# EAGLE schematic driver led v12 (EAGLE 9.7.0)
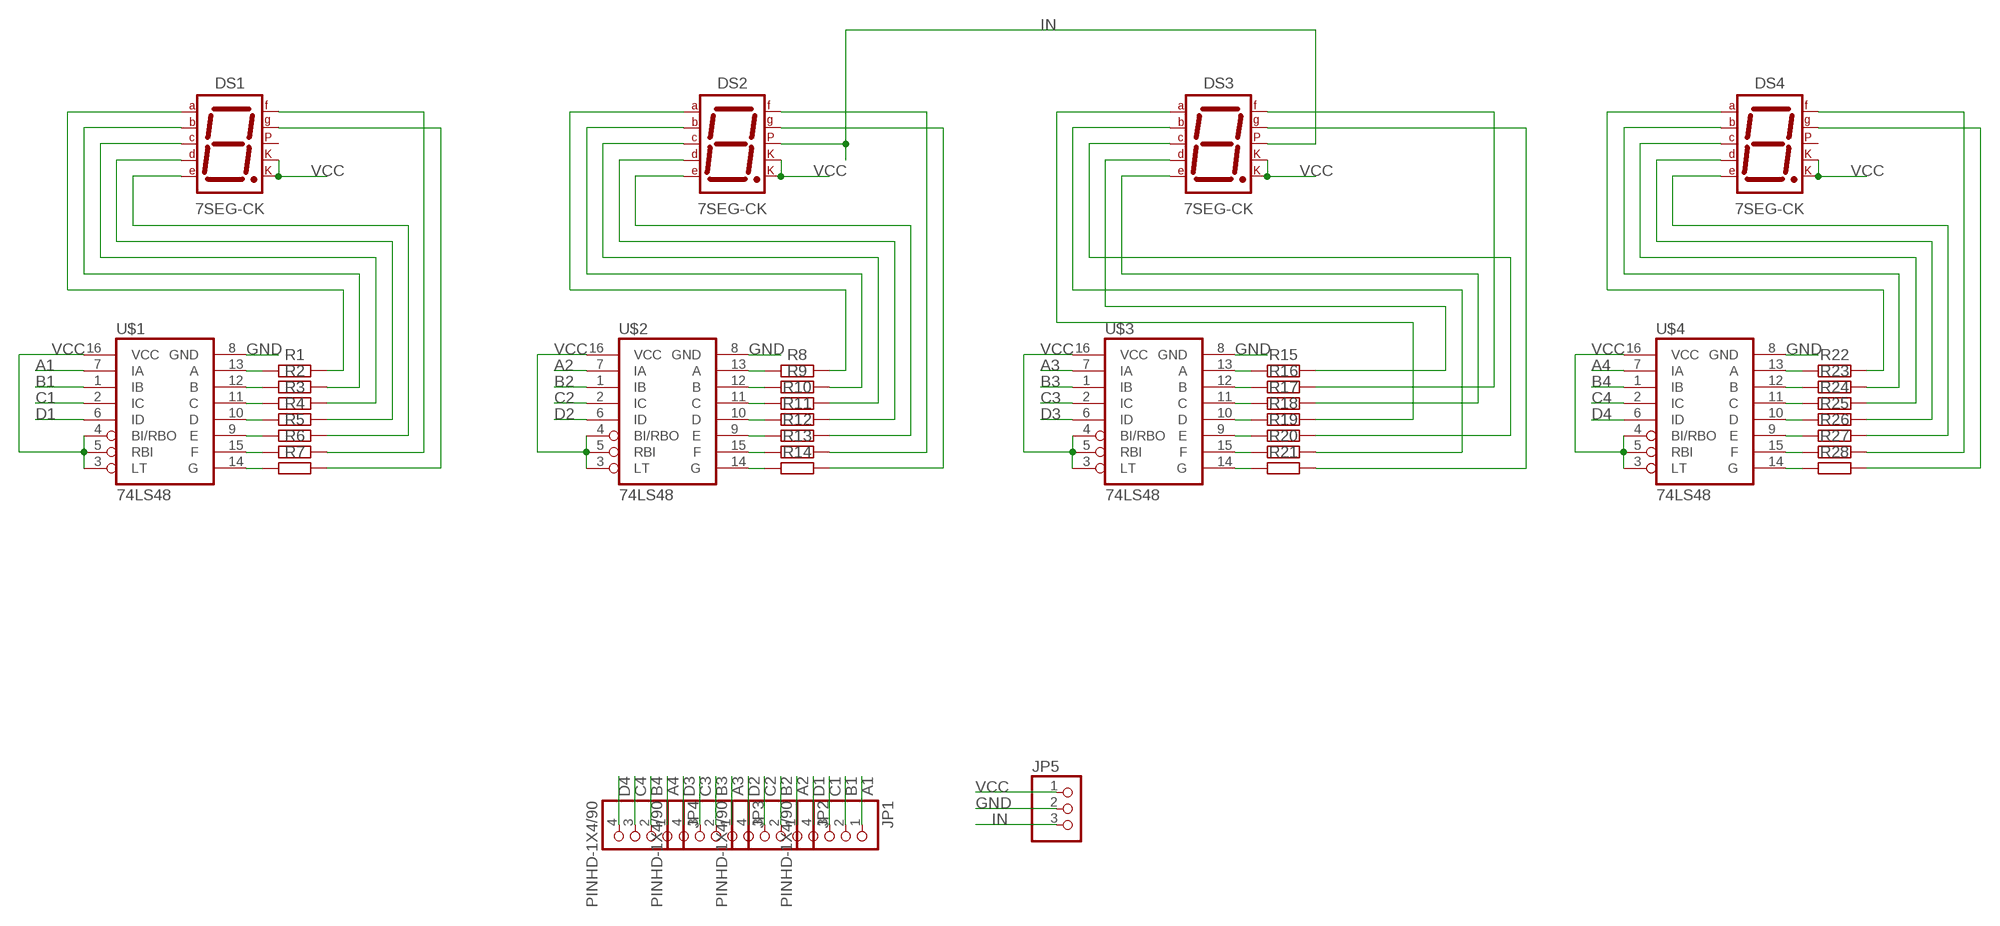
[diagram p0: schematic, sheet 1]

## Parts
DS1  7SEG-CK  [7SEG-13]
DS2  7SEG-CK  [7SEG-13]
DS3  7SEG-CK  [7SEG-13]
DS4  7SEG-CK  [7SEG-13]
JP1  PINHD-1X4/90  [1X04/90]
JP2  PINHD-1X4/90  [1X04/90]
JP3  PINHD-1X4/90  [1X04/90]
JP4  PINHD-1X4/90  [1X04/90]
JP5  PINHD-1X3CB  [1X03-CLEANBIG]
R1  R_AXIAL-7.2MM-PITCH  [RESAD724W46L381D178B]
R2  R_AXIAL-7.2MM-PITCH  [RESAD724W46L381D178B]
R3  R_AXIAL-7.2MM-PITCH  [RESAD724W46L381D178B]
R4  R_AXIAL-7.2MM-PITCH  [RESAD724W46L381D178B]
R5  R_AXIAL-7.2MM-PITCH  [RESAD724W46L381D178B]
R6  R_AXIAL-7.2MM-PITCH  [RESAD724W46L381D178B]
R7  R_AXIAL-7.2MM-PITCH  [RESAD724W46L381D178B]
R8  R_AXIAL-7.2MM-PITCH  [RESAD724W46L381D178B]
R9  R_AXIAL-7.2MM-PITCH  [RESAD724W46L381D178B]
R10  R_AXIAL-7.2MM-PITCH  [RESAD724W46L381D178B]
R11  R_AXIAL-7.2MM-PITCH  [RESAD724W46L381D178B]
R12  R_AXIAL-7.2MM-PITCH  [RESAD724W46L381D178B]
R13  R_AXIAL-7.2MM-PITCH  [RESAD724W46L381D178B]
R14  R_AXIAL-7.2MM-PITCH  [RESAD724W46L381D178B]
R15  R_AXIAL-7.2MM-PITCH  [RESAD724W46L381D178B]
R16  R_AXIAL-7.2MM-PITCH  [RESAD724W46L381D178B]
R17  R_AXIAL-7.2MM-PITCH  [RESAD724W46L381D178B]
R18  R_AXIAL-7.2MM-PITCH  [RESAD724W46L381D178B]
R19  R_AXIAL-7.2MM-PITCH  [RESAD724W46L381D178B]
R20  R_AXIAL-7.2MM-PITCH  [RESAD724W46L381D178B]
R21  R_AXIAL-7.2MM-PITCH  [RESAD724W46L381D178B]
R22  R_AXIAL-7.2MM-PITCH  [RESAD724W46L381D178B]
R23  R_AXIAL-7.2MM-PITCH  [RESAD724W46L381D178B]
R24  R_AXIAL-7.2MM-PITCH  [RESAD724W46L381D178B]
R25  R_AXIAL-7.2MM-PITCH  [RESAD724W46L381D178B]
R26  R_AXIAL-7.2MM-PITCH  [RESAD724W46L381D178B]
R27  R_AXIAL-7.2MM-PITCH  [RESAD724W46L381D178B]
R28  R_AXIAL-7.2MM-PITCH  [RESAD724W46L381D178B]
U$1  74LS48  [DIO16]
U$2  74LS48  [DIO16]
U$3  74LS48  [DIO16]
U$4  74LS48  [DIO16]

## Nets
A1: JP1.1 U$1.7(IA)
A2: JP2.1 U$2.7(IA)
A3: JP3.1 U$3.7(IA)
A4: JP4.1 U$4.7(IA)
B1: JP1.2 U$1.1(IB)
B2: JP2.2 U$2.1(IB)
B3: JP3.2 U$3.1(IB)
B4: JP4.2 U$4.1(IB)
C1: JP1.3 U$1.2(IC)
C2: JP2.3 U$2.2(IC)
C3: JP3.3 U$3.2(IC)
C4: JP4.3 U$4.2(IC)
D1: JP1.4 U$1.6(ID)
D2: JP2.4 U$2.6(ID)
D3: JP3.4 U$3.6(ID)
D4: JP4.4 U$4.6(ID)
GND: JP5.2 U$1.8(GND) U$2.8(GND) U$3.8(GND) U$4.8(GND)
IN: DS2.5(DP) DS3.5(DP) JP5.3
N$1: DS1.7(A) R1.2
N$2: DS1.6(B) R2.2
N$3: DS1.4(C) R3.2
N$4: DS1.2(D) R4.2
N$5: DS1.1(E) R5.2
N$6: R1.1 U$1.13(A)
N$7: R2.1 U$1.12(B)
N$9: DS2.7(A) R8.2
N$10: DS2.6(B) R9.2
N$11: R3.1 U$1.11(C)
N$12: R4.1 U$1.10(D)
N$13: R5.1 U$1.9(E)
N$14: DS1.9(F) R6.2
N$15: DS1.10(G) R7.2
N$16: R6.1 U$1.15(F)
N$17: R7.1 U$1.14(G)
N$18: DS2.4(C) R10.2
N$19: DS2.2(D) R11.2
N$20: DS2.1(E) R12.2
N$22: DS2.9(F) R13.2
N$23: DS2.10(G) R14.2
N$24: R8.1 U$2.13(A)
N$25: R9.1 U$2.12(B)
N$26: R10.1 U$2.11(C)
N$27: R11.1 U$2.10(D)
N$28: R12.1 U$2.9(E)
N$29: R13.1 U$2.15(F)
N$30: R14.1 U$2.14(G)
N$31: DS3.7(A) R18.2
N$32: DS3.6(B) R20.2
N$37: DS3.9(F) R16.2
N$39: R15.1 U$3.13(A)
N$40: R16.1 U$3.12(B)
N$41: R17.1 U$3.11(C)
N$42: R18.1 U$3.10(D)
N$43: R19.1 U$3.9(E)
N$44: R20.1 U$3.15(F)
N$45: R21.1 U$3.14(G)
N$46: DS4.7(A) R22.2
N$47: DS4.6(B) R23.2
N$48: DS4.4(C) R24.2
N$49: DS4.2(D) R25.2
N$50: DS4.1(E) R26.2
N$52: DS4.9(F) R27.2
N$53: DS4.10(G) R28.2
N$54: R22.1 U$4.13(A)
N$55: R23.1 U$4.12(B)
N$56: R24.1 U$4.11(C)
N$57: R25.1 U$4.10(D)
N$58: R26.1 U$4.9(E)
N$59: R27.1 U$4.15(F)
N$60: R28.1 U$4.14(G)
N$61: DS3.1(E) R17.2
N$62: DS3.2(D) R15.2
N$63: DS3.4(C) R19.2
N$67: DS3.10(G) R21.2
VCC: DS1.3(CK1) DS1.8(CK2) DS2.3(CK1) DS2.8(CK2) DS3.3(CK1) DS3.8(CK2) DS4.3(CK1) DS4.8(CK2) JP5.1 U$1.3(LT) U$1.4(BI/RBO) U$1.5(RBI) U$1.16(VCC) U$2.3(LT) U$2.4(BI/RBO) U$2.5(RBI) U$2.16(VCC) U$3.3(LT) U$3.4(BI/RBO) U$3.5(RBI) U$3.16(VCC) U$4.3(LT) U$4.4(BI/RBO) U$4.5(RBI) U$4.16(VCC)
Unconnected: DS1.5(DP) DS4.5(DP)

## Library data of the parts
DS1-DS4 = Opto-Electronic:7SEG-CK: 7-segment DISPLAY single cathode, 13 mm; CATEGORY: Opto-Electronic; SUB-CATEGORY: Display; TYPE: 7-Segment
JP1-JP4 = Connector:PINHD-1X4: PIN HEADER; CATEGORY: CONNECTOR; SUB-CATEGORY: PIN-HEADER
JP5 = adafruit:PINHD-1X3: PIN HEADER
R1-R28 = Resistor:R: Resistor Fixed - Generic; CATEGORY: Resistor; SUB-CATEGORY: Fixed
U$1-U$4 = Library:74LS48